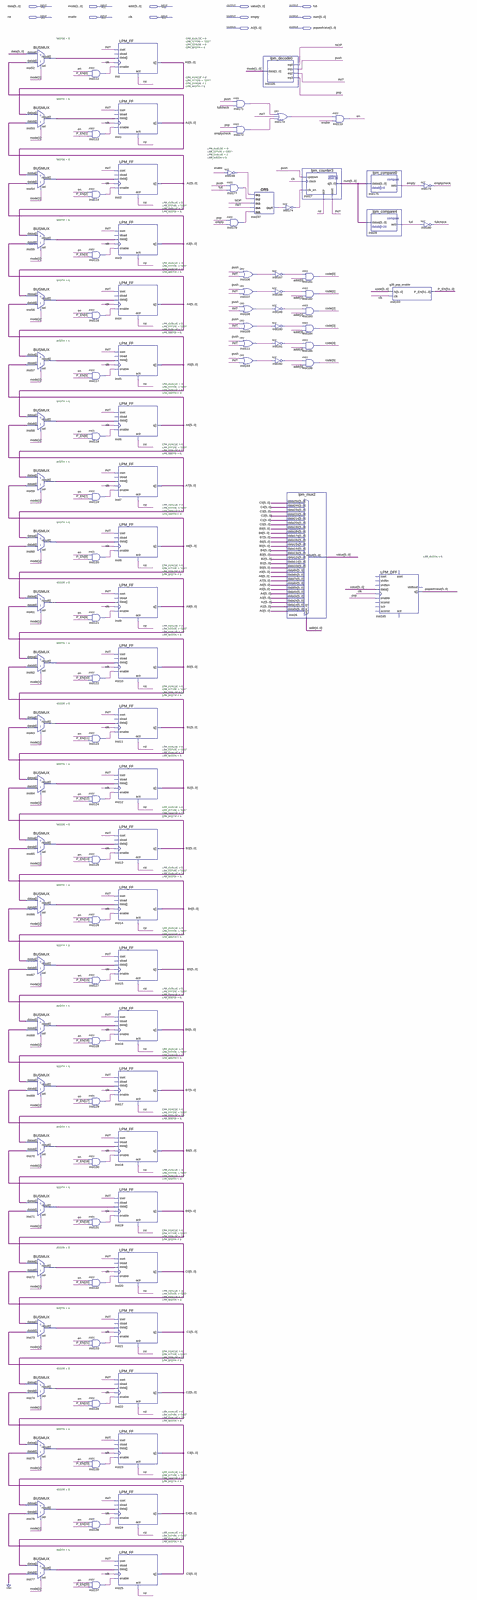
[diagram p0: schematic sheet, whole]
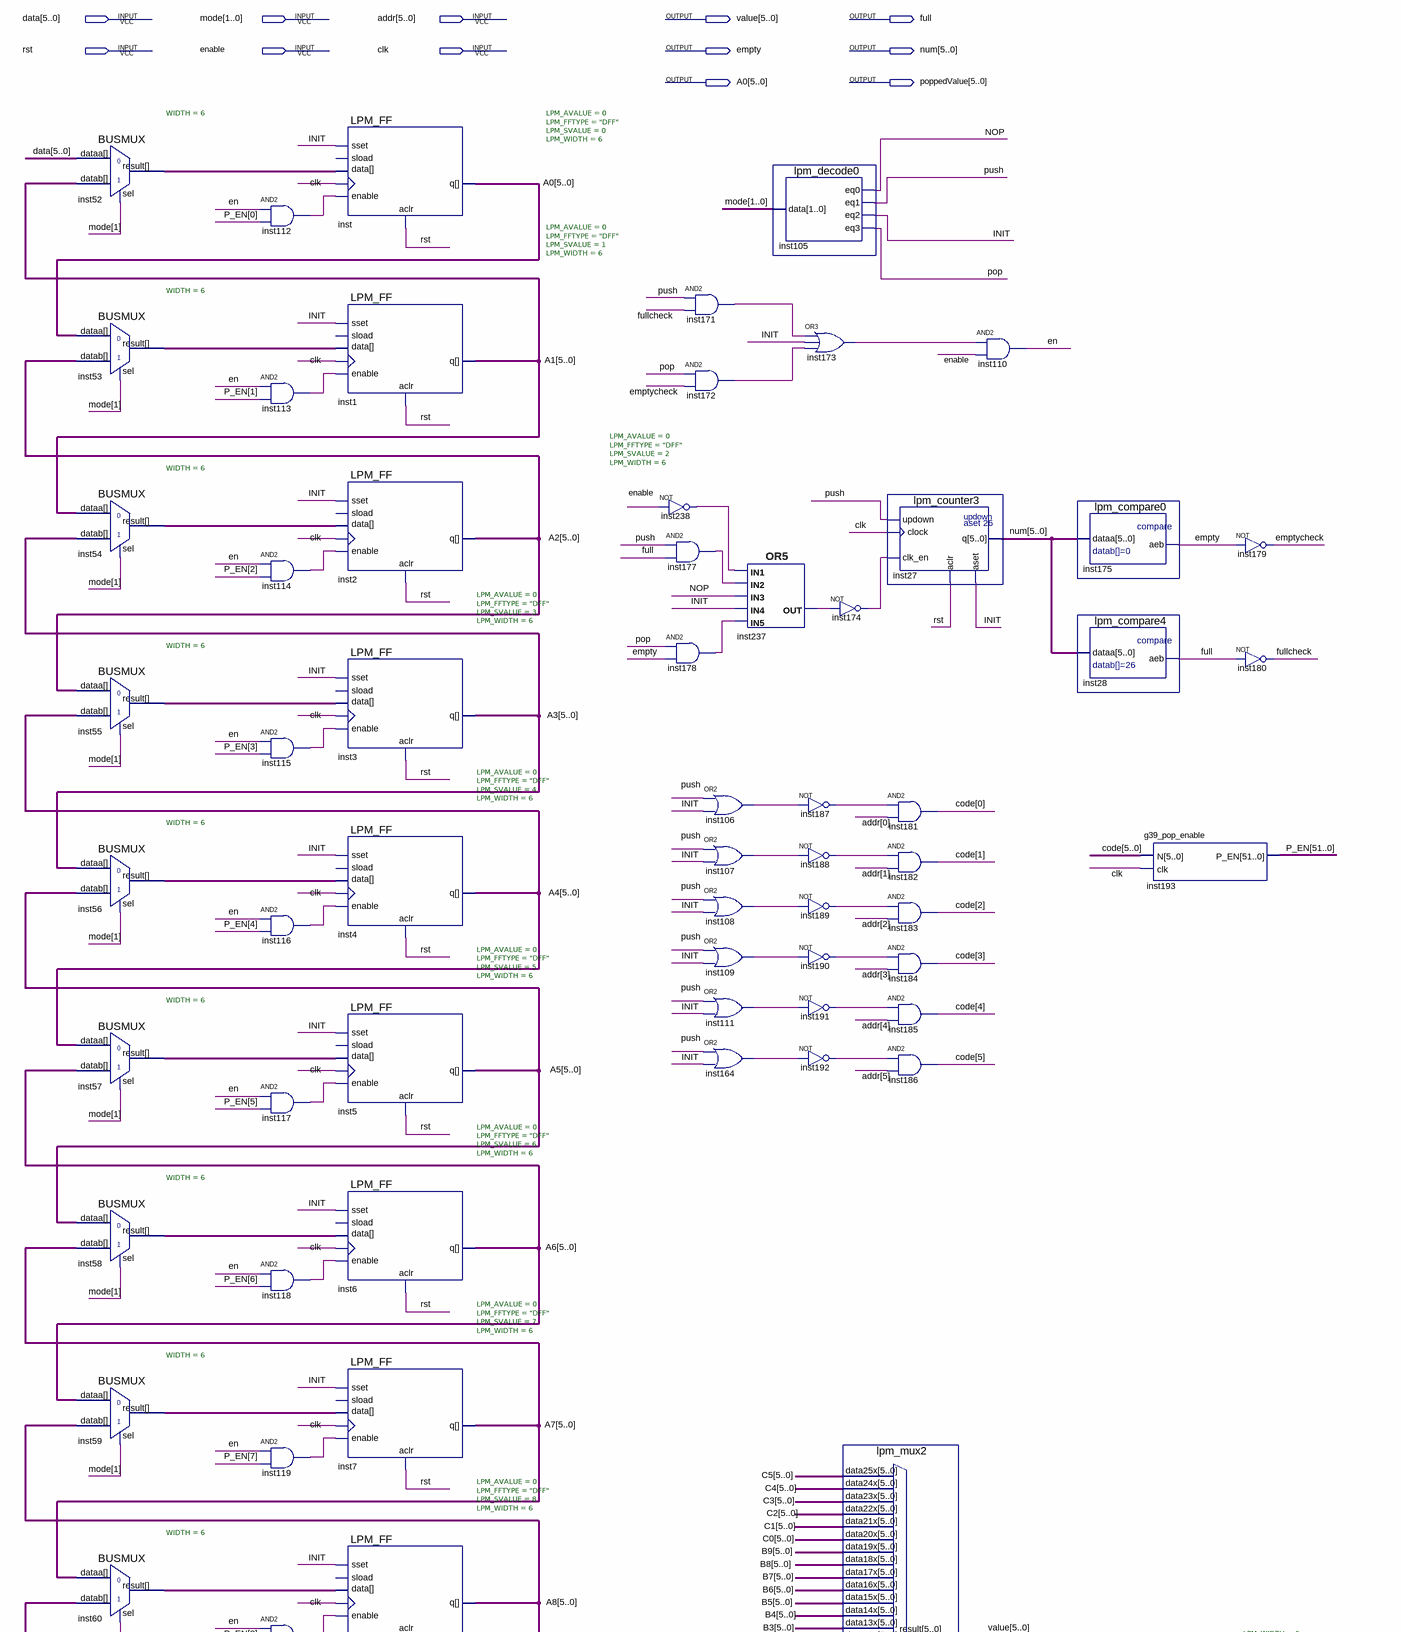
[diagram p1: schematic sheet, upper part]
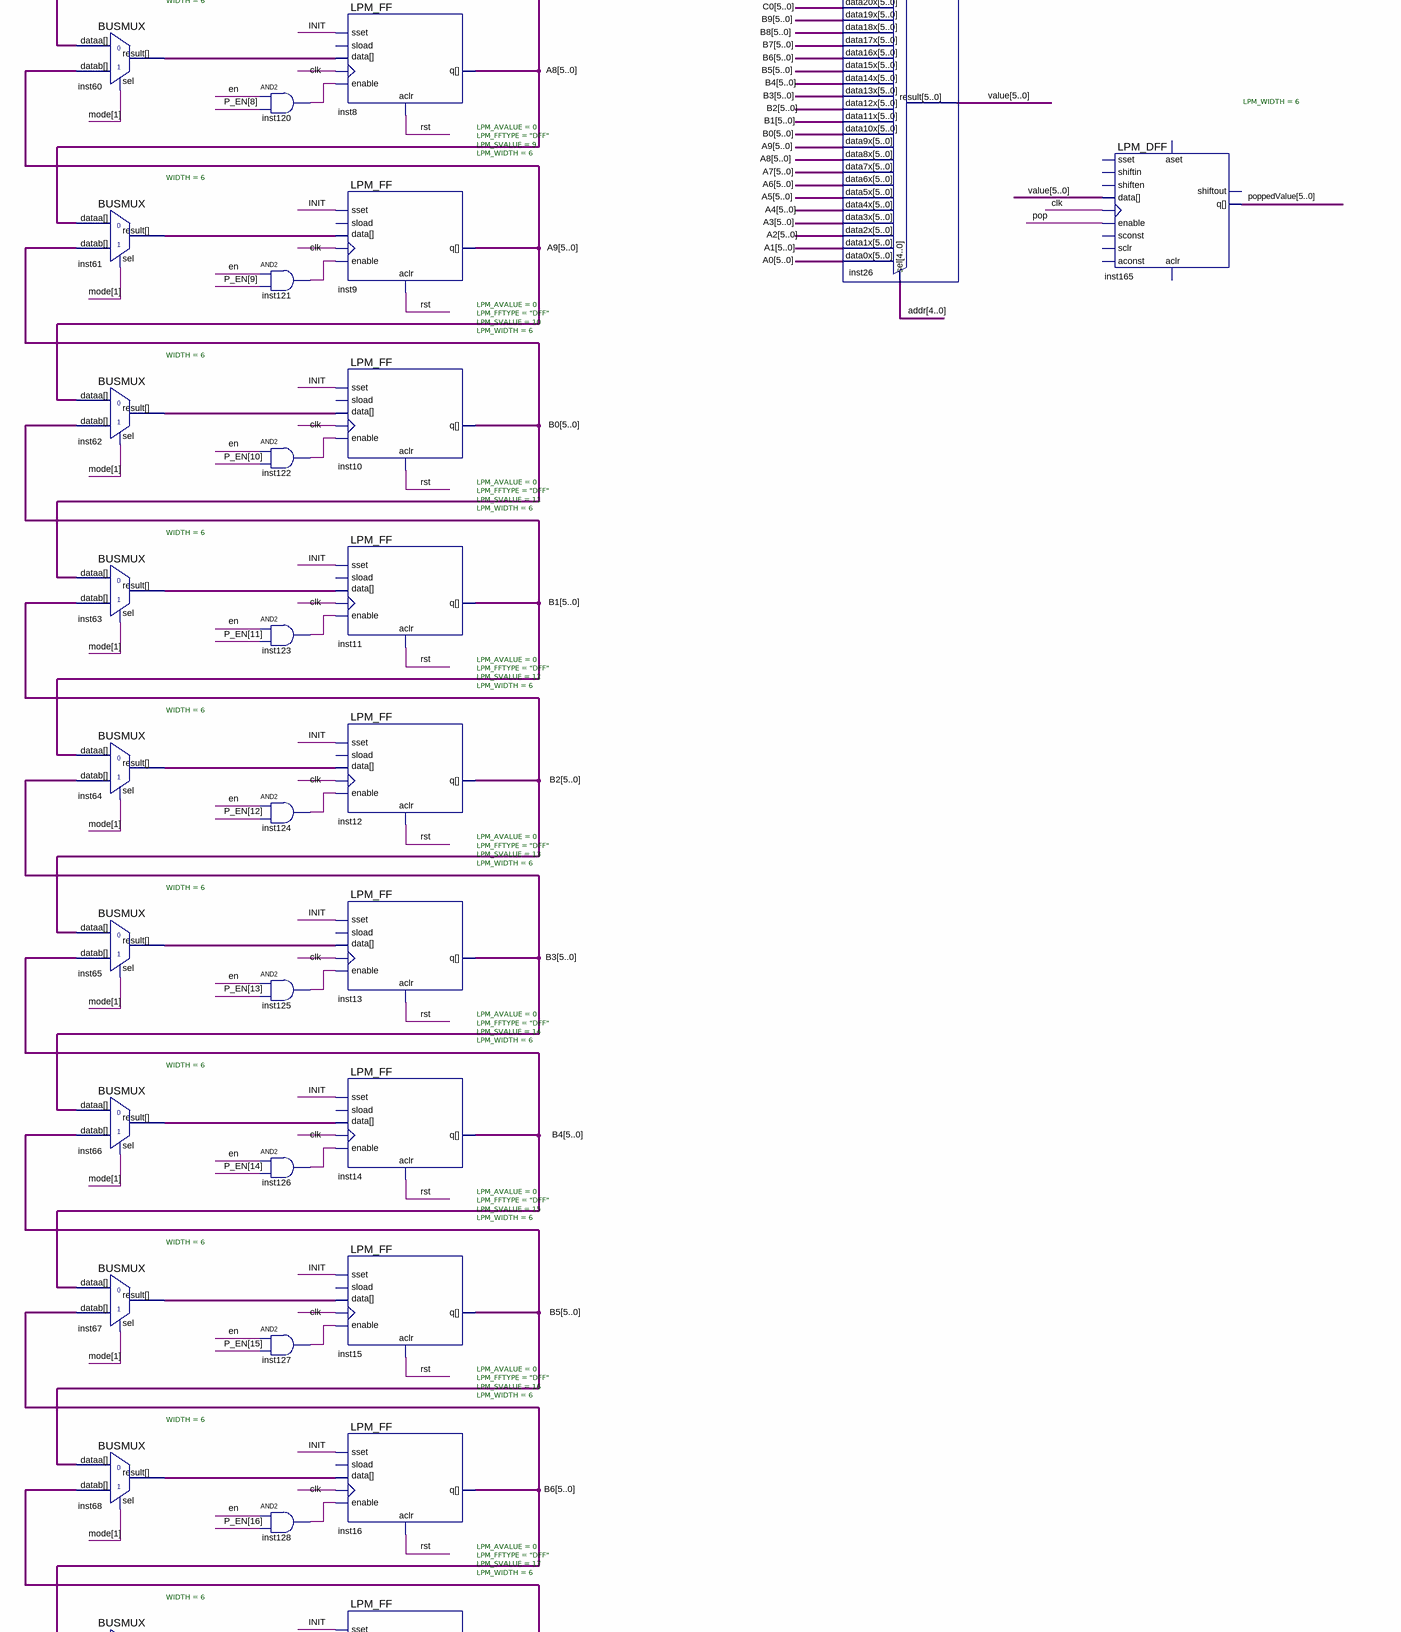
[diagram p2: schematic sheet, middle part]
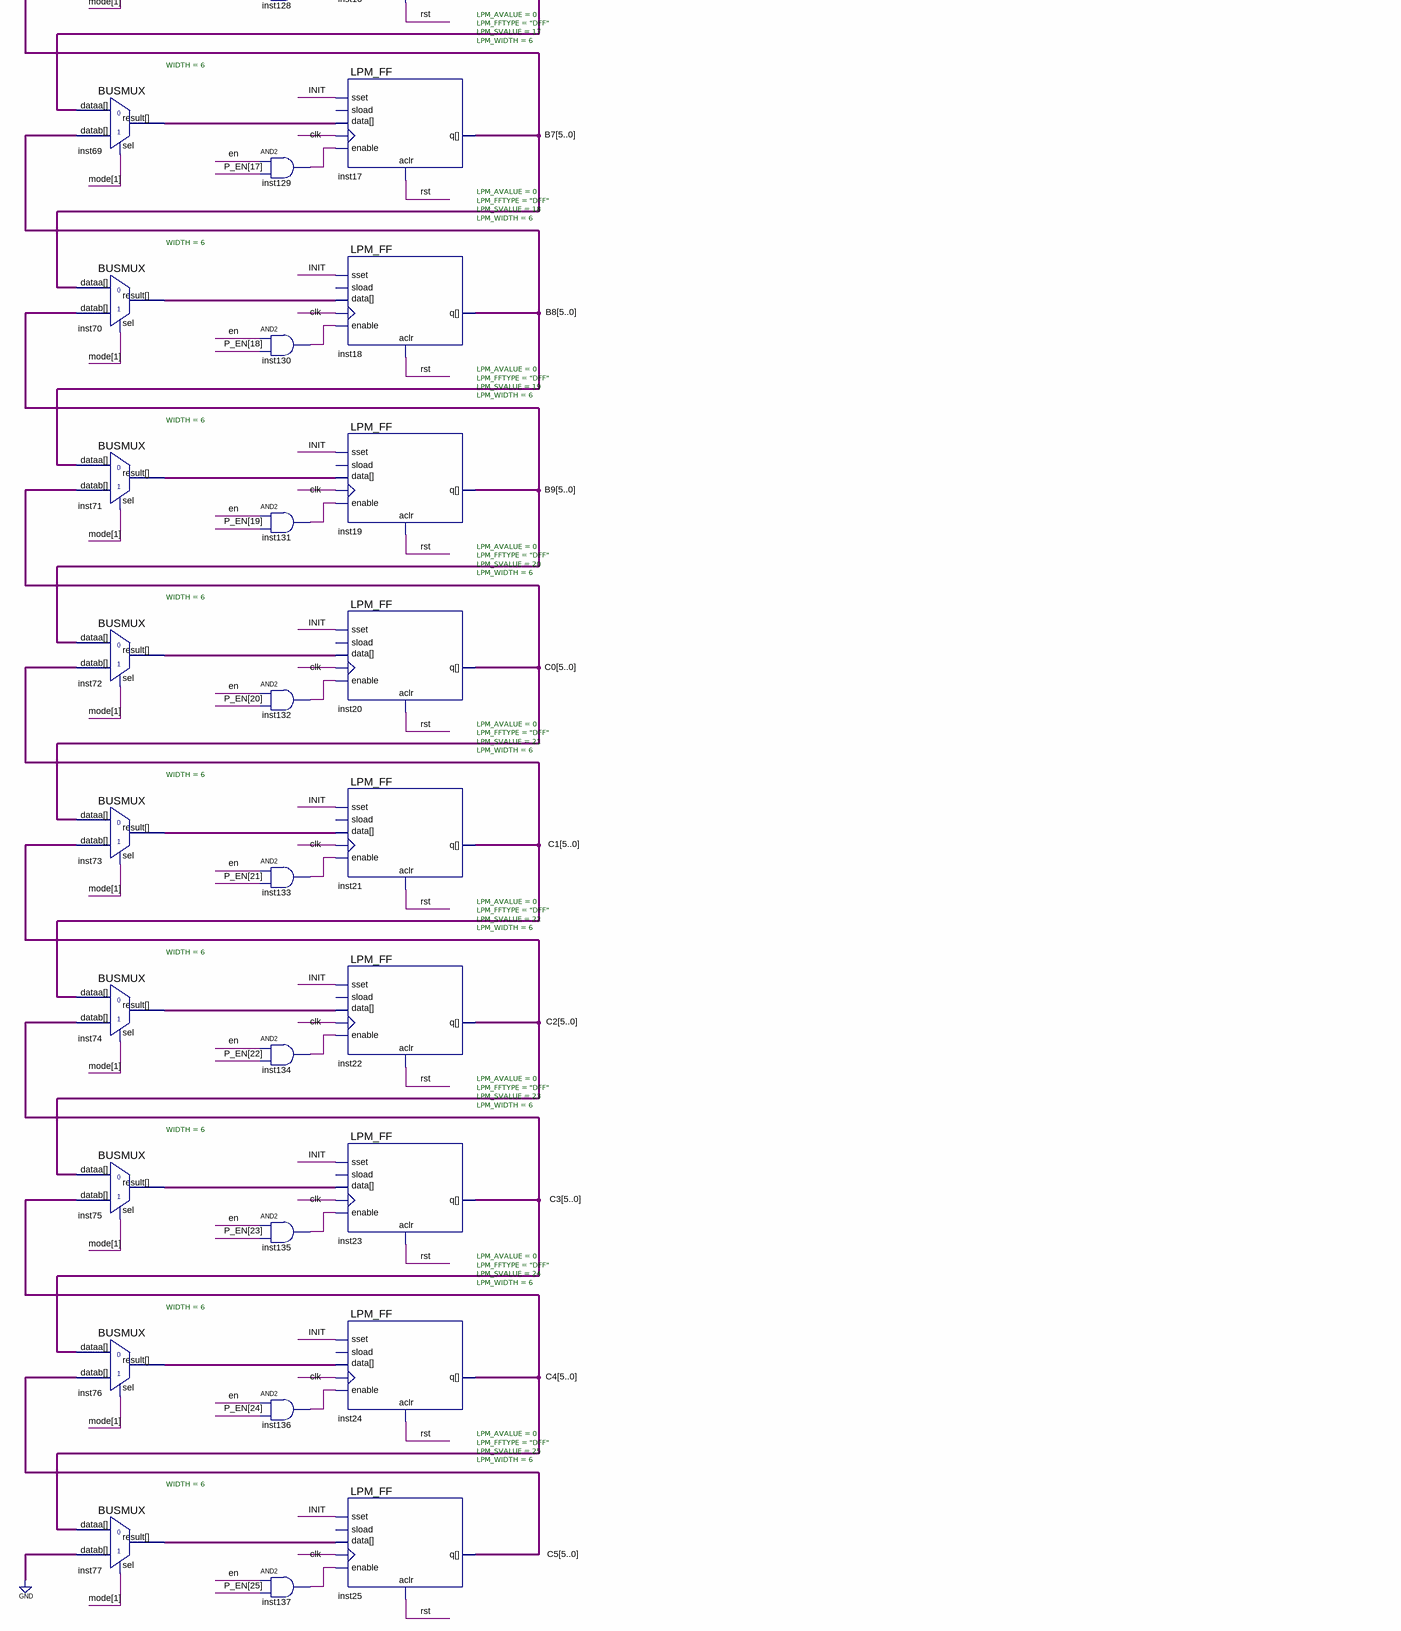
[diagram p3: schematic sheet, lower part]
// Quartus schematic g39_stack26.bdf as structural Verilog: 114 symbols, 12 pins
module g39_stack26 (
  input  [5:0] data,
  input  [1:0] mode,
  input  [5:0] addr,
  input  rst,
  input  enable,
  input  clk,
  output [5:0] value,
  output full,
  output empty,
  output [5:0] num,
  output [5:0] A0,
  output [5:0] poppedValue
);

  wire emptycheck, en, fullcheck, INIT, inst106_out, inst107_out, inst108_out, inst109_out, inst111_out,
       inst112_out, inst113_out, inst114_out, inst115_out, inst116_out, inst117_out, inst118_out,
       inst119_out, inst120_out, inst121_out, inst122_out, inst123_out, inst124_out, inst125_out,
       inst126_out, inst127_out, inst128_out, inst129_out, inst130_out, inst131_out, inst132_out,
       inst133_out, inst134_out, inst135_out, inst136_out, inst137_out, inst164_out, inst171_out,
       inst172_out, inst173_out, inst174_out, inst177_out, inst178_out, inst187_out, inst188_out,
       inst189_out, inst190_out, inst191_out, inst192_out, inst237_out, inst238_out, NOP, pop, push;
  wire [5:0] A1, A2, A3, A4, A5, A6, A7, A8, A9, B0, B1, B2, B3, B4, B5, B6, B7, B8, B9, C0, C1, C2, C3, C4,
       C5, code, inst52_result, inst53_result, inst54_result, inst55_result, inst56_result, inst57_result,
       inst58_result, inst59_result, inst60_result, inst61_result, inst62_result, inst63_result,
       inst64_result, inst65_result, inst66_result, inst67_result, inst68_result, inst69_result,
       inst70_result, inst71_result, inst72_result, inst73_result, inst74_result, inst75_result,
       inst76_result, inst77_result;
  wire [51:0] P_EN;

  BUSMUX #(.WIDTH(6)) inst52 (.datab(A1), .sel(mode[1]), .dataa(data), .result(inst52_result));
  BUSMUX #(.WIDTH(6)) inst53 (.datab(A2), .sel(mode[1]), .dataa(A0), .result(inst53_result));
  BUSMUX #(.WIDTH(6)) inst54 (.datab(A3), .sel(mode[1]), .dataa(A1), .result(inst54_result));
  BUSMUX #(.WIDTH(6)) inst55 (.datab(A4), .sel(mode[1]), .dataa(A2), .result(inst55_result));
  BUSMUX #(.WIDTH(6)) inst56 (.datab(A5), .sel(mode[1]), .dataa(A3), .result(inst56_result));
  BUSMUX #(.WIDTH(6)) inst57 (.datab(A6), .sel(mode[1]), .dataa(A4), .result(inst57_result));
  BUSMUX #(.WIDTH(6)) inst58 (.datab(A7), .sel(mode[1]), .dataa(A5), .result(inst58_result));
  BUSMUX #(.WIDTH(6)) inst59 (.datab(A8), .sel(mode[1]), .dataa(A6), .result(inst59_result));
  BUSMUX #(.WIDTH(6)) inst60 (.datab(A9), .sel(mode[1]), .dataa(A7), .result(inst60_result));
  BUSMUX #(.WIDTH(6)) inst61 (.datab(B0), .sel(mode[1]), .dataa(A8), .result(inst61_result));
  BUSMUX #(.WIDTH(6)) inst62 (.datab(B1), .sel(mode[1]), .dataa(A9), .result(inst62_result));
  BUSMUX #(.WIDTH(6)) inst63 (.datab(B2), .sel(mode[1]), .dataa(B0), .result(inst63_result));
  BUSMUX #(.WIDTH(6)) inst64 (.datab(B3), .sel(mode[1]), .dataa(B1), .result(inst64_result));
  BUSMUX #(.WIDTH(6)) inst65 (.datab(B4), .sel(mode[1]), .dataa(B2), .result(inst65_result));
  BUSMUX #(.WIDTH(6)) inst66 (.datab(B5), .sel(mode[1]), .dataa(B3), .result(inst66_result));
  BUSMUX #(.WIDTH(6)) inst67 (.datab(B6), .sel(mode[1]), .dataa(B4), .result(inst67_result));
  BUSMUX #(.WIDTH(6)) inst68 (.datab(B7), .sel(mode[1]), .dataa(B5), .result(inst68_result));
  BUSMUX #(.WIDTH(6)) inst69 (.datab(B8), .sel(mode[1]), .dataa(B6), .result(inst69_result));
  BUSMUX #(.WIDTH(6)) inst70 (.datab(B9), .sel(mode[1]), .dataa(B7), .result(inst70_result));
  BUSMUX #(.WIDTH(6)) inst71 (.datab(C0), .sel(mode[1]), .dataa(B8), .result(inst71_result));
  BUSMUX #(.WIDTH(6)) inst72 (.datab(C1), .sel(mode[1]), .dataa(B9), .result(inst72_result));
  BUSMUX #(.WIDTH(6)) inst73 (.datab(C2), .sel(mode[1]), .dataa(C0), .result(inst73_result));
  BUSMUX #(.WIDTH(6)) inst74 (.datab(C3), .sel(mode[1]), .dataa(C1), .result(inst74_result));
  BUSMUX #(.WIDTH(6)) inst75 (.datab(C4), .sel(mode[1]), .dataa(C2), .result(inst75_result));
  BUSMUX #(.WIDTH(6)) inst76 (.datab(C5), .sel(mode[1]), .dataa(C3), .result(inst76_result));
  BUSMUX #(.WIDTH(6)) inst77 (.datab({6{1'b0}}), .sel(mode[1]), .dataa(C4), .result(inst77_result));
  and inst112 (inst112_out, en, P_EN[0]);
  and inst113 (inst113_out, en, P_EN[1]);
  and inst114 (inst114_out, en, P_EN[2]);
  and inst115 (inst115_out, en, P_EN[3]);
  and inst116 (inst116_out, en, P_EN[4]);
  and inst117 (inst117_out, en, P_EN[5]);
  and inst118 (inst118_out, en, P_EN[6]);
  and inst119 (inst119_out, en, P_EN[7]);
  and inst120 (inst120_out, en, P_EN[8]);
  and inst121 (inst121_out, en, P_EN[9]);
  and inst122 (inst122_out, en, P_EN[10]);
  and inst123 (inst123_out, en, P_EN[11]);
  and inst124 (inst124_out, en, P_EN[12]);
  and inst125 (inst125_out, en, P_EN[13]);
  and inst126 (inst126_out, en, P_EN[14]);
  and inst127 (inst127_out, en, P_EN[15]);
  and inst128 (inst128_out, en, P_EN[16]);
  and inst129 (inst129_out, en, P_EN[17]);
  and inst130 (inst130_out, en, P_EN[18]);
  and inst131 (inst131_out, en, P_EN[19]);
  and inst132 (inst132_out, en, P_EN[20]);
  and inst133 (inst133_out, en, P_EN[21]);
  and inst134 (inst134_out, en, P_EN[22]);
  and inst135 (inst135_out, en, P_EN[23]);
  and inst136 (inst136_out, en, P_EN[24]);
  and inst137 (inst137_out, en, P_EN[25]);
  LPM_FF #(.LPM_AVALUE(0), .LPM_FFTYPE("DFF"), .LPM_SVALUE(0), .LPM_WIDTH(6)) inst (
    .enable(inst112_out), .clock(clk), .sset(INIT), .aclr(rst), .data(inst52_result), .q(A0));  // open: sload
  LPM_FF #(.LPM_AVALUE(0), .LPM_FFTYPE("DFF"), .LPM_SVALUE(1), .LPM_WIDTH(6)) inst1 (
    .enable(inst113_out), .clock(clk), .sset(INIT), .aclr(rst), .data(inst53_result), .q(A1));  // open: sload
  LPM_FF #(.LPM_AVALUE(0), .LPM_FFTYPE("DFF"), .LPM_SVALUE(2), .LPM_WIDTH(6)) inst2 (
    .enable(inst114_out), .clock(clk), .sset(INIT), .aclr(rst), .data(inst54_result), .q(A2));  // open: sload
  LPM_FF #(.LPM_AVALUE(0), .LPM_FFTYPE("DFF"), .LPM_SVALUE(3), .LPM_WIDTH(6)) inst3 (
    .enable(inst115_out), .clock(clk), .sset(INIT), .aclr(rst), .data(inst55_result), .q(A3));  // open: sload
  LPM_FF #(.LPM_AVALUE(0), .LPM_FFTYPE("DFF"), .LPM_SVALUE(4), .LPM_WIDTH(6)) inst4 (
    .enable(inst116_out), .clock(clk), .sset(INIT), .aclr(rst), .data(inst56_result), .q(A4));  // open: sload
  LPM_FF #(.LPM_AVALUE(0), .LPM_FFTYPE("DFF"), .LPM_SVALUE(5), .LPM_WIDTH(6)) inst5 (
    .enable(inst117_out), .clock(clk), .sset(INIT), .aclr(rst), .data(inst57_result), .q(A5));  // open: sload
  LPM_FF #(.LPM_AVALUE(0), .LPM_FFTYPE("DFF"), .LPM_SVALUE(6), .LPM_WIDTH(6)) inst6 (
    .enable(inst118_out), .clock(clk), .sset(INIT), .aclr(rst), .data(inst58_result), .q(A6));  // open: sload
  LPM_FF #(.LPM_AVALUE(0), .LPM_FFTYPE("DFF"), .LPM_SVALUE(7), .LPM_WIDTH(6)) inst7 (
    .enable(inst119_out), .clock(clk), .sset(INIT), .aclr(rst), .data(inst59_result), .q(A7));  // open: sload
  LPM_FF #(.LPM_AVALUE(0), .LPM_FFTYPE("DFF"), .LPM_SVALUE(8), .LPM_WIDTH(6)) inst8 (
    .enable(inst120_out), .clock(clk), .sset(INIT), .aclr(rst), .data(inst60_result), .q(A8));  // open: sload
  LPM_FF #(.LPM_AVALUE(0), .LPM_FFTYPE("DFF"), .LPM_SVALUE(9), .LPM_WIDTH(6)) inst9 (
    .enable(inst121_out), .clock(clk), .sset(INIT), .aclr(rst), .data(inst61_result), .q(A9));  // open: sload
  LPM_FF #(.LPM_AVALUE(0), .LPM_FFTYPE("DFF"), .LPM_SVALUE(10), .LPM_WIDTH(6)) inst10 (
    .enable(inst122_out), .clock(clk), .sset(INIT), .aclr(rst), .data(inst62_result), .q(B0));  // open: sload
  LPM_FF #(.LPM_AVALUE(0), .LPM_FFTYPE("DFF"), .LPM_SVALUE(11), .LPM_WIDTH(6)) inst11 (
    .enable(inst123_out), .clock(clk), .sset(INIT), .aclr(rst), .data(inst63_result), .q(B1));  // open: sload
  LPM_FF #(.LPM_AVALUE(0), .LPM_FFTYPE("DFF"), .LPM_SVALUE(12), .LPM_WIDTH(6)) inst12 (
    .enable(inst124_out), .clock(clk), .sset(INIT), .aclr(rst), .data(inst64_result), .q(B2));  // open: sload
  LPM_FF #(.LPM_AVALUE(0), .LPM_FFTYPE("DFF"), .LPM_SVALUE(13), .LPM_WIDTH(6)) inst13 (
    .enable(inst125_out), .clock(clk), .sset(INIT), .aclr(rst), .data(inst65_result), .q(B3));  // open: sload
  LPM_FF #(.LPM_AVALUE(0), .LPM_FFTYPE("DFF"), .LPM_SVALUE(14), .LPM_WIDTH(6)) inst14 (
    .enable(inst126_out), .clock(clk), .sset(INIT), .aclr(rst), .data(inst66_result), .q(B4));  // open: sload
  LPM_FF #(.LPM_AVALUE(0), .LPM_FFTYPE("DFF"), .LPM_SVALUE(15), .LPM_WIDTH(6)) inst15 (
    .enable(inst127_out), .clock(clk), .sset(INIT), .aclr(rst), .data(inst67_result), .q(B5));  // open: sload
  LPM_FF #(.LPM_AVALUE(0), .LPM_FFTYPE("DFF"), .LPM_SVALUE(16), .LPM_WIDTH(6)) inst16 (
    .enable(inst128_out), .clock(clk), .sset(INIT), .aclr(rst), .data(inst68_result), .q(B6));  // open: sload
  LPM_FF #(.LPM_AVALUE(0), .LPM_FFTYPE("DFF"), .LPM_SVALUE(17), .LPM_WIDTH(6)) inst17 (
    .enable(inst129_out), .clock(clk), .sset(INIT), .aclr(rst), .data(inst69_result), .q(B7));  // open: sload
  LPM_FF #(.LPM_AVALUE(0), .LPM_FFTYPE("DFF"), .LPM_SVALUE(18), .LPM_WIDTH(6)) inst18 (
    .enable(inst130_out), .clock(clk), .sset(INIT), .aclr(rst), .data(inst70_result), .q(B8));  // open: sload
  LPM_FF #(.LPM_AVALUE(0), .LPM_FFTYPE("DFF"), .LPM_SVALUE(19), .LPM_WIDTH(6)) inst19 (
    .enable(inst131_out), .clock(clk), .sset(INIT), .aclr(rst), .data(inst71_result), .q(B9));  // open: sload
  LPM_FF #(.LPM_AVALUE(0), .LPM_FFTYPE("DFF"), .LPM_SVALUE(20), .LPM_WIDTH(6)) inst20 (
    .enable(inst132_out), .clock(clk), .sset(INIT), .aclr(rst), .data(inst72_result), .q(C0));  // open: sload
  LPM_FF #(.LPM_AVALUE(0), .LPM_FFTYPE("DFF"), .LPM_SVALUE(21), .LPM_WIDTH(6)) inst21 (
    .enable(inst133_out), .clock(clk), .sset(INIT), .aclr(rst), .data(inst73_result), .q(C1));  // open: sload
  LPM_FF #(.LPM_AVALUE(0), .LPM_FFTYPE("DFF"), .LPM_SVALUE(22), .LPM_WIDTH(6)) inst22 (
    .enable(inst134_out), .clock(clk), .sset(INIT), .aclr(rst), .data(inst74_result), .q(C2));  // open: sload
  LPM_FF #(.LPM_AVALUE(0), .LPM_FFTYPE("DFF"), .LPM_SVALUE(23), .LPM_WIDTH(6)) inst23 (
    .enable(inst135_out), .clock(clk), .sset(INIT), .aclr(rst), .data(inst75_result), .q(C3));  // open: sload
  LPM_FF #(.LPM_AVALUE(0), .LPM_FFTYPE("DFF"), .LPM_SVALUE(24), .LPM_WIDTH(6)) inst24 (
    .enable(inst136_out), .clock(clk), .sset(INIT), .aclr(rst), .data(inst76_result), .q(C4));  // open: sload
  LPM_FF #(.LPM_AVALUE(0), .LPM_FFTYPE("DFF"), .LPM_SVALUE(25), .LPM_WIDTH(6)) inst25 (
    .enable(inst137_out), .clock(clk), .sset(INIT), .aclr(rst), .data(inst77_result), .q(C5));  // open: sload
  and inst171 (inst171_out, push, fullcheck);
  and inst172 (inst172_out, pop, emptycheck);
  not inst238 (inst238_out, enable);
  and inst177 (inst177_out, push, full);
  and inst178 (inst178_out, pop, empty);
  or inst237 (inst237_out, inst238_out, inst177_out, NOP, INIT, inst178_out);
  or inst106 (inst106_out, push, INIT);
  or inst107 (inst107_out, push, INIT);
  or inst108 (inst108_out, push, INIT);
  or inst109 (inst109_out, push, INIT);
  or inst111 (inst111_out, push, INIT);
  or inst164 (inst164_out, push, INIT);
  lpm_decode0 inst105 (.data(mode), .eq0(NOP), .eq1(push), .eq2(INIT), .eq3(pop));
  or inst173 (inst173_out, inst171_out, INIT, inst172_out);
  not inst174 (inst174_out, inst237_out);
  not inst187 (inst187_out, inst106_out);
  not inst188 (inst188_out, inst107_out);
  not inst189 (inst189_out, inst108_out);
  not inst190 (inst190_out, inst109_out);
  not inst191 (inst191_out, inst111_out);
  not inst192 (inst192_out, inst164_out);
  lpm_counter3 inst27 (.updown(push), .clock(clk), .clk_en(inst174_out), .aclr(rst), .aset(INIT), .q(num));
  and inst181 (code[0], inst187_out, addr[0]);
  and inst182 (code[1], inst188_out, addr[1]);
  and inst183 (code[2], inst189_out, addr[2]);
  and inst184 (code[3], inst190_out, addr[3]);
  and inst185 (code[4], inst191_out, addr[4]);
  and inst186 (code[5], inst192_out, addr[5]);
  lpm_mux2 inst26 (
    .data25x(C5), .data24x(C4), .data23x(C3), .data22x(C2), .data21x(C1), .data20x(C0), .data19x(B9),
    .data18x(B8), .data17x(B7), .data16x(B6), .data15x(B5), .data14x(B4), .data13x(B3), .data12x(B2),
    .data11x(B1), .data10x(B0), .data9x(A9), .data8x(A8), .data7x(A7), .data6x(A6), .data5x(A5), .data4x(A4),
    .data3x(A3), .data2x(A2), .data1x(A1), .data0x(A0), .sel(addr[4:0]), .result(value));
  and inst110 (en, inst173_out, enable);
  lpm_compare0 inst175 (.dataa(num), .aeb(empty));
  lpm_compare4 inst28 (.dataa(num), .aeb(full));
  g39_pop_enable inst193 (.N(code), .clk(clk), .P_EN(P_EN));
  LPM_DFF #(.LPM_WIDTH(6)) inst165 (
    .enable(pop), .clock(clk), .data(value), .q(poppedValue));  // open: shiftin, shiften, aconst, sclr, sconst, sset, aset, aclr, shiftout
  not inst179 (emptycheck, empty);
  not inst180 (fullcheck, full);
endmodule
